# EAGLE schematic weichen-a-2 (EAGLE 9.6.2)
AUTHOR: Balazs Racz; DRAWING_TITLE: MEB Schalterwerk Projekt; LICENSE: Licensed by the Solderpad Hardware License V2.0; REVIEWER: n/a; REVISION: A; YEAR: 2023
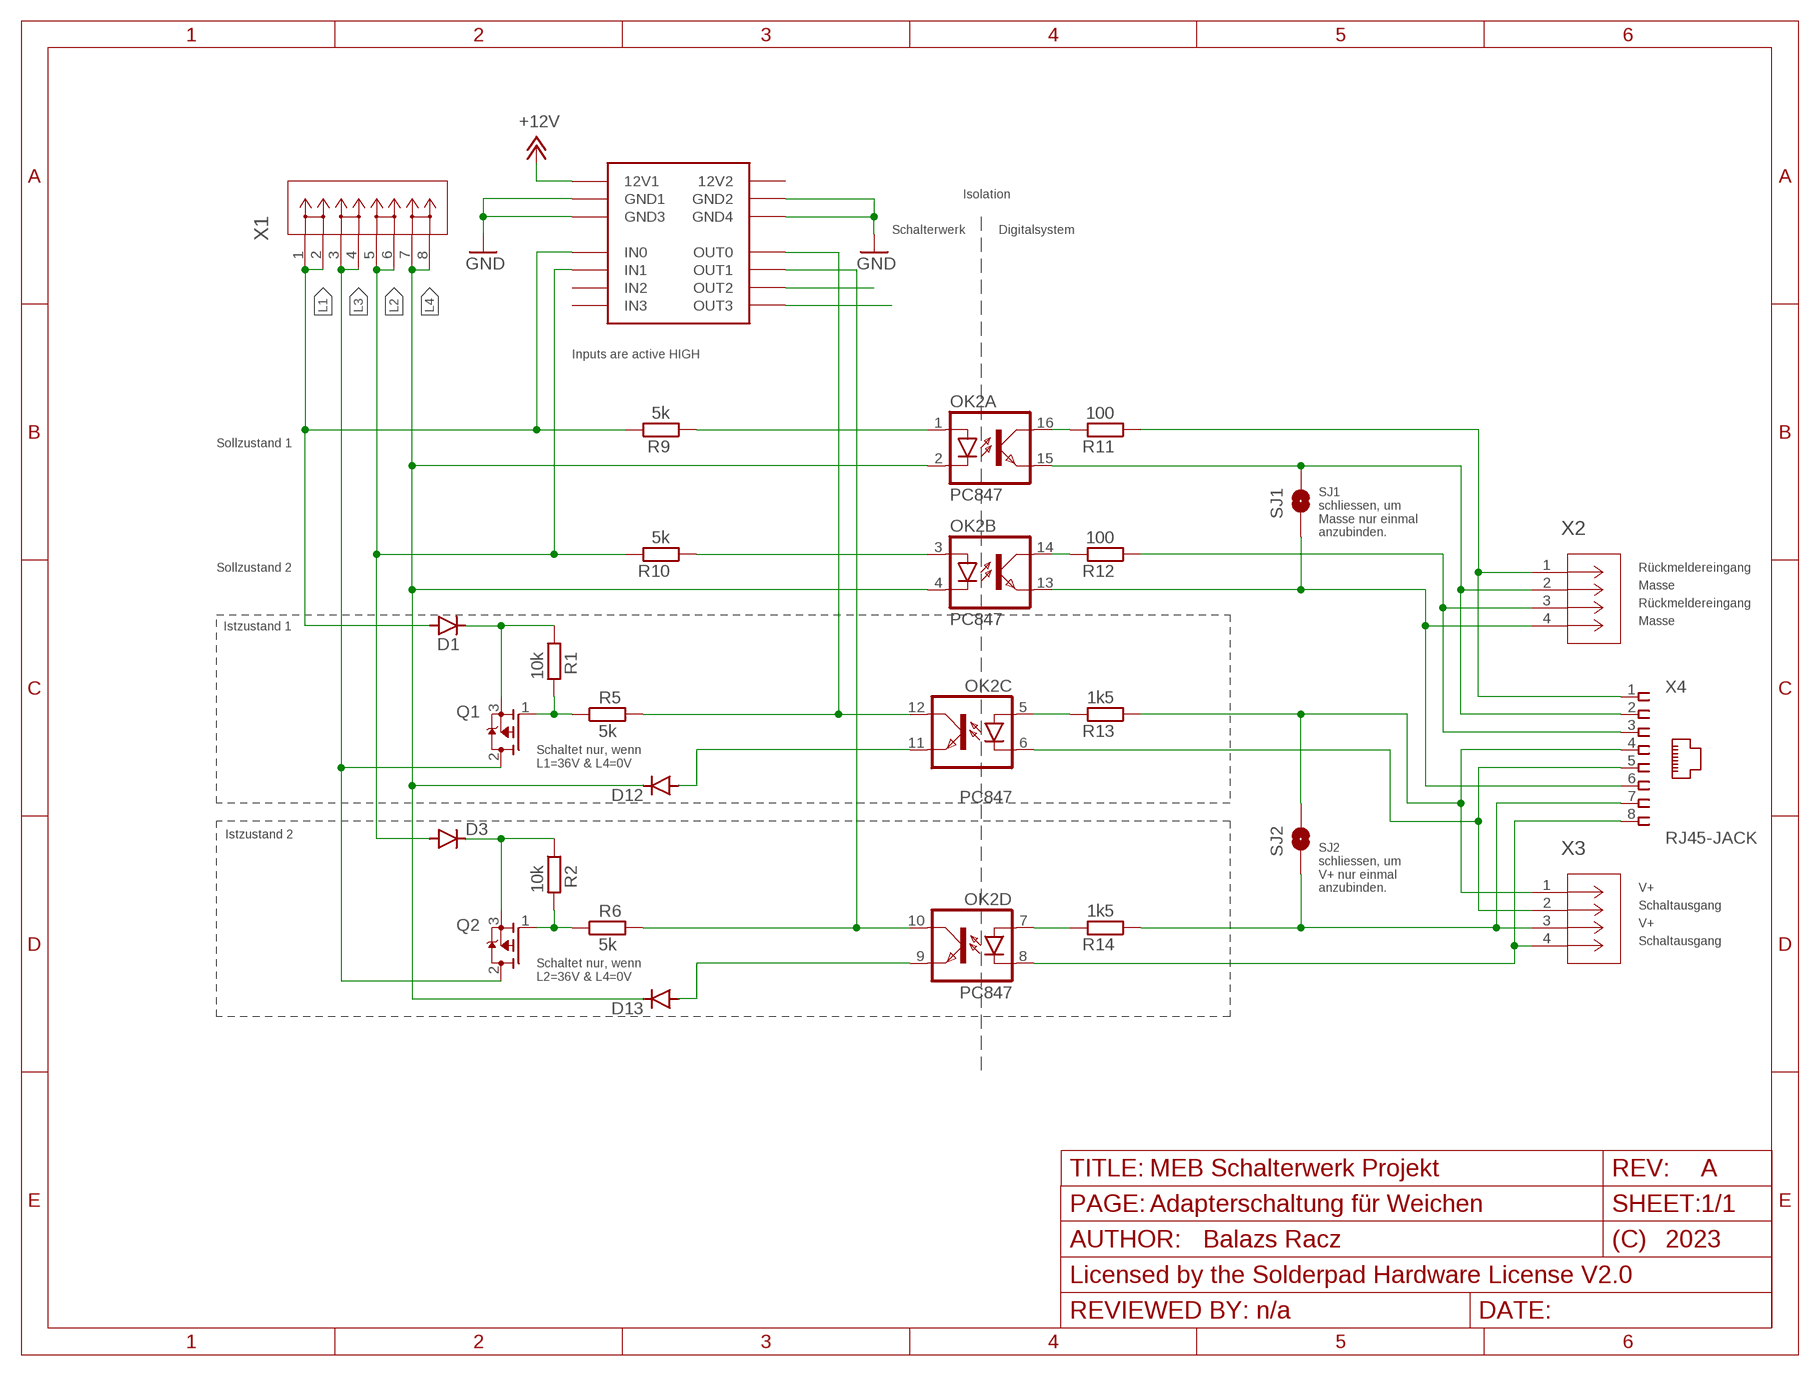
[diagram p0: schematic, sheet 1]
FRAME1 (FRAME_A_L): PAGE: Input ports
FRAME2 (FRAME_A_L): PAGE: Adapterschaltung für Weichen

## Parts
D1  DIODE-DO214AC  [DO214AC]
D3  DIODE-DO214AC  [DO214AC]
D12  DIODE-MINIMELF  [MINIMELF]
D13  DIODE-MINIMELF  [MINIMELF]
OK2  PC847  [DIL16]
Q1  P-MOSFET  [DPAK-2]
Q2  P-MOSFET  [DPAK-2]
R1  10k  R-EU_R0805  [R0805]
R2  10k  R-EU_R0805  [R0805]
R5  5k  R-EU_R0805  [R0805]
R6  5k  R-EU_R0805  [R0805]
R9  5k  R-EU_R0805  [R0805]
R10  5k  R-EU_R0805  [R0805]
R11  100  R-EU_R0805  [R0805]
R12  100  R-EU_R0805  [R0805]
R13  1k5  R-EU_R0805  [R0805]
R14  1k5  R-EU_R0805  [R0805]
SJ1  SJRND2  [SJ_RND2]
SJ2  SJRND2  [SJ_RND2]
X1  PHNX_4P_508CONN_1017493  [PHNX_4P_508]
X2  PHNX_4P_350CONN_1984989_PXC  [PHNX_4P_350]
X3  PHNX_4P_350CONN_1984989_PXC  [PHNX_4P_350]
X4  RJ45-JACK  RJ45-JACKRJ45-PULSE-E5J00  [RJ45-PULSE-E5J88]
X5  IO-HAT  [IOBOARD]

## Nets
+12V: X5.P$1(12V1)
GND: X5.P$2(GND1) X5.P$11(GND3) X5.P$12(GND4) X5.P$21(GND2)
L1: D1.A R9.2 X1.1 X1.2 X5.P$3(IN0)
L2: D3.A R10.2 X1.5 X1.6 X5.P$4(IN1)
L3: Q1.2(D) Q2.2(D) X1.3 X1.4
L4: D12.C D13.C OK2.2(A:C) OK2.4(B:C) X1.7 X1.8
N$1: D3.C Q2.3(S) R2.1
N$2: OK2.1(A:A) R9.1
N$3: R11.1 X2.1 X4.1
N$4: OK2.15(A:EMIT) SJ1.P$2 X2.2 X4.2
N$5: OK2.5(C:A) R13.2
N$6: R12.1 X2.3 X4.3
N$7: OK2.3(B:A) R10.1
N$8: OK2.7(D:A) R14.2
N$9: Q1.1(G) R1.2 R5.1
N$12: Q2.1(G) R2.2 R6.1
N$13: D1.C Q1.3(S) R1.1
N$14: OK2.6(C:C) X3.2 X4.5
N$15: OK2.12(C:COL) R5.2 X5.P$20(OUT0)
N$16: OK2.10(D:COL) R6.2 X5.P$19(OUT1)
N$17: D12.A OK2.11(C:EMIT)
N$19: OK2.16(A:COL) R11.2
N$20: OK2.13(B:EMIT) SJ1.P$1 X2.4 X4.6
N$21: OK2.14(B:COL) R12.2
N$22: D13.A OK2.9(D:EMIT)
N$24: X5.P$18(OUT2)
N$25: X5.P$17(OUT3)
N$26: R13.1 SJ2.P$2 X3.1 X4.4
N$32: R14.1 SJ2.P$1 X3.3 X4.7
N$39: OK2.8(D:C) X3.4 X4.8
Unconnected: X5.P$5(IN2) X5.P$6(IN3) X5.P$7(IN4) X5.P$8(IN5) X5.P$9(IN6) X5.P$10(IN7) X5.P$13(OUT7) X5.P$14(OUT6) X5.P$15(OUT5) X5.P$16(OUT4)

## Notes on the sheet
- Isolation
- Schalterwerk | Digitalsystem
- Inputs are active HIGH
- Sollzustand 1
- SJ1
  schliessen, um
  Masse nur einmal
  anzubinden.
- Sollzustand 2 | Rückmeldereingang
- Masse
- Rückmeldereingang
- Masse
- Istzustand 1
- Schaltet nur, wenn
  L1=36V & L4=0V
- Istzustand 2
- SJ2
  schliessen, um
  V+ nur einmal
  anzubinden.
- V+
- Schaltausgang
- V+
- Schaltausgang
- Schaltet nur, wenn
  L2=36V & L4=0V

## Power pins joined to a net without a drawn wire
12V2: X5.P$22(12V2)

## Library data of the parts
D1 D3 D12 D13 = diode:DIODE-: DIODE
OK2 = optocoupler:PC847: SHARP OPTO COUPLER; OC_FARNELL: 9707735; OC_NEWARK: unknown
Q1 Q2 = eagleparts:P-MOSFET: RoHS Compliant | Low RDS(on) | Industry-leading quality | Dynamic dv/dt Rating | Fast Switching | Fully Avalanche Rated | 175C Operating Temperature | P-Channel MOSFET; MANUFACTURER: Infineon; MAXIMUM_PACKAGE_HEIGHT: 2.39 mm; PARTREV: 12/14/04; STANDARD: IPC-7351B
R1 R2 R5 R6 R9-R14 = rcl:R-EU_: RESISTOR, European symbol; SPICEPREFIX: R
SJ1 SJ2 = eagleparts:SJ: SMD solder JUMPER
X1 = eagleparts:PHNX_4P_508: https://www.digikey.com/en/products/detail/phoenix-contact/1017505/9346606 DigiKey 277-17516-ND; COPYRIGHT: Copyright (C) 2023 Ultra Librarian. All rights reserved.; MANUFACTURER_PART_NUMBER: 1017505; MFR_NAME: Phoenix Contact
X2 X3 = eagleparts:PHNX_4P_350: https://www.digikey.com/en/products/detail/phoenix-contact/1984989/2513979 DigiKey 277-6404-ND; COPYRIGHT: Copyright (C) 2023 Ultra Librarian. All rights reserved.; MANUFACTURER_PART_NUMBER: 1984989; MFR_NAME: Phoenix Contact
X4 = trainlib:RJ45-JACK: Mod. Jack, Right Angle, 8 posiotion, 8 contatcs RJ45 Source: GLX-S-88M.pdf
X5 = eagleparts:IO-HAT